# Altium schematic sheet MAIN.SchDoc
size A4
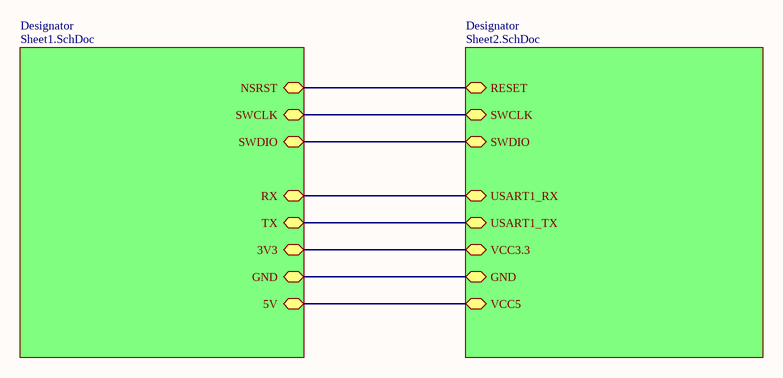
[diagram p0: MAIN.SchDoc]

## Sub-sheets
Designator = Sheet1.SchDoc: NSRST, SWCLK, SWDIO, RX, TX, 3V3, GND, 5V
Designator = Sheet2.SchDoc: VCC3.3, USART1_TX, USART1_RX, SWCLK, SWDIO, RESET, GND, VCC5

## Nets
(unnamed): sheet Designator/NSRST, sheet Designator/RESET
(unnamed): sheet Designator/SWCLK, sheet Designator/SWCLK
(unnamed): sheet Designator/SWDIO, sheet Designator/SWDIO
(unnamed): sheet Designator/RX, sheet Designator/USART1_RX
(unnamed): sheet Designator/TX, sheet Designator/USART1_TX
(unnamed): sheet Designator/3V3, sheet Designator/VCC3.3
(unnamed): sheet Designator/GND, sheet Designator/GND
(unnamed): sheet Designator/5V, sheet Designator/VCC5